# Altium schematic sheet microcontroller.SchDoc
size A4
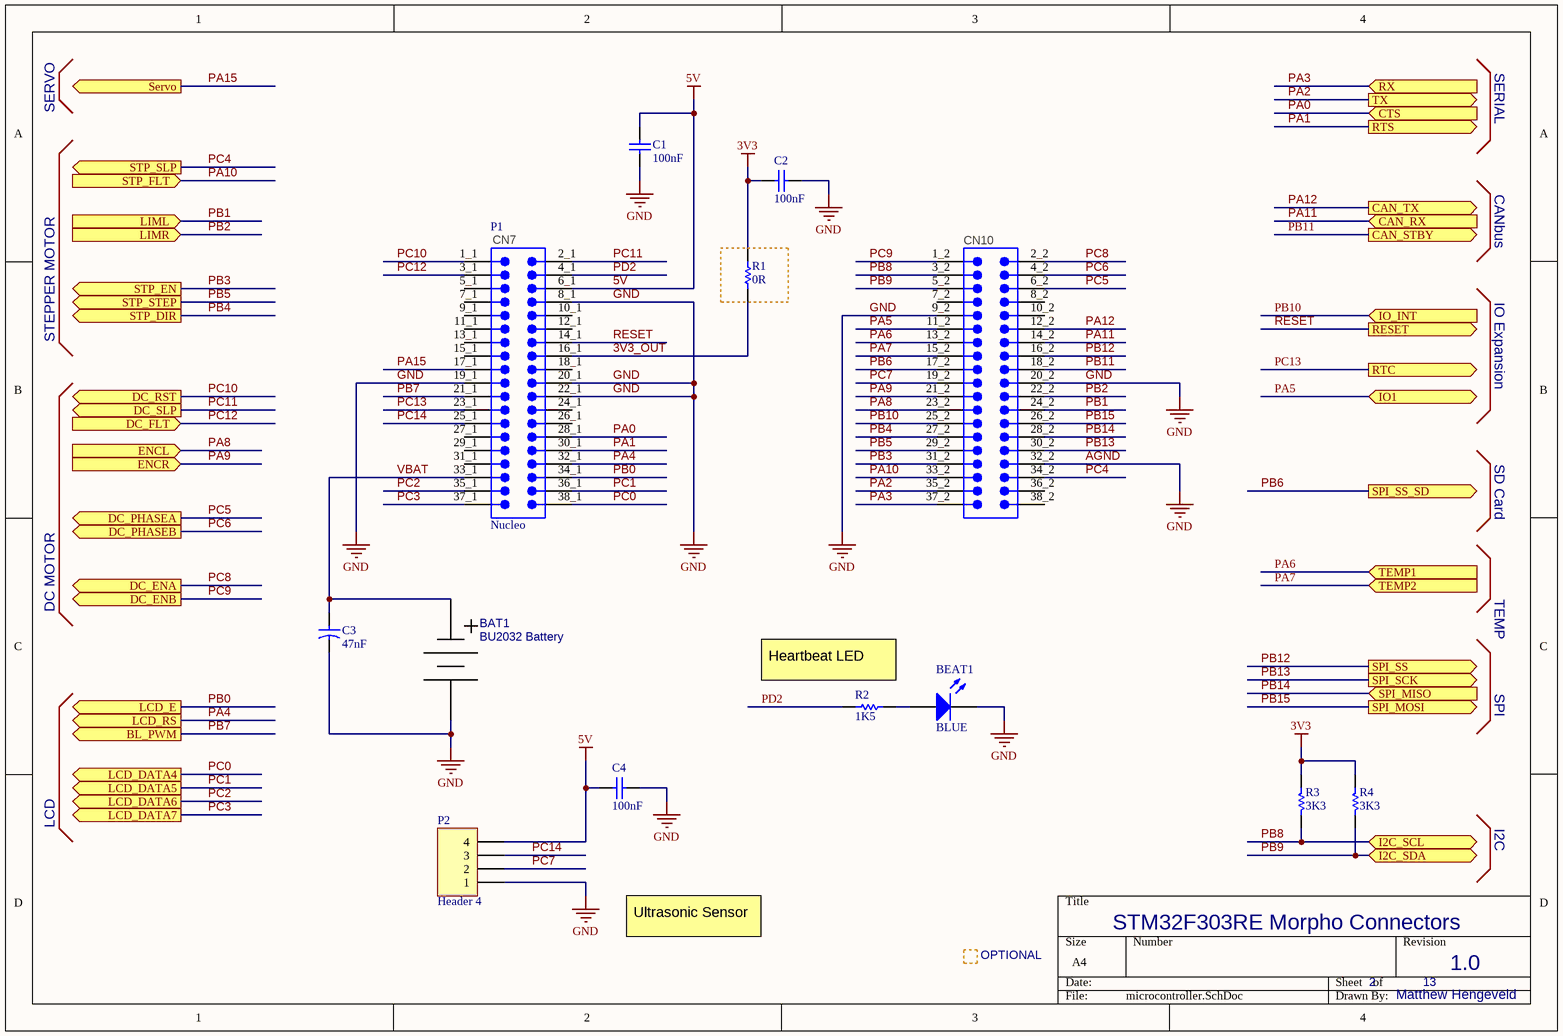
[diagram p0: microcontroller.SchDoc]

## Parts
BAT1  BU2032 Battery  [BU2032]
BEAT1  BLUE  [0805_A]
C1  100nF  [CAPC1608X92X38LL15T08]
C2  100nF  [CAPC1608X92X38LL15T08]
C3  47nF  [FILM_CAp]
C4  100nF  [CAPC1608X92X38LL15T08]
P1  Nucleo  [NUCLEO]
P2  Header 4  [HDR1X4]
R1  0R  [RESC1608X55X30LL15T15]
R2  1K5  [RESC1608X55X30LL15T15]
R3  3K3  [RESC1608X55X30LL15T15]
R4  3K3  [RESC1608X55X30LL15T15]

## Ports
BL_PWM (out), CAN_RX (in), CAN_STBY (out), CAN_TX (out), CTS (in), DC_ENA (out), DC_ENB (out), DC_FLT (in), DC_PHASEA (out), DC_PHASEB (out), DC_RST (out), DC_SLP (out), ENCL (in), ENCR (in), I2C_SCL (bidir), I2C_SDA (bidir), IO1 (bidir), IO_INT (in), LCD_DATA4 (out), LCD_DATA5 (out), LCD_DATA6 (out), LCD_DATA7 (out), LCD_E (out), LCD_RS (out), LIML (in), LIMR (in), RESET (out), RTC (out), RTS (out), RX (in), Servo (out), SPI_MISO (in), SPI_MOSI (out), SPI_SCK (out), SPI_SS (out), SPI_SS_SD (out), STP_DIR (out), STP_EN (out), STP_FLT (in), STP_SLP (out), STP_STEP (out), TEMP1 (in), TEMP2 (in), TX (out)

## Nets
3V3: C2.2 R1.2 R3.1 R4.1
5V: C1.2 C4.2 P1.6_1 P2.4
AGND: BAT1.- BEAT1.1(K) C1.1 C2.1 C3.2 C4.1 P1.8_1 P1.9_2 P1.19_1 P1.20_1 P1.20_2 P1.22_1 P1.32_2 P2.1  [also labelled GND]
3V3_OUT: P1.16_1 R1.1
PA0: P1.28_1 ; port CTS
PA1: P1.30_1 ; port RTS
PA2: P1.35_2 ; port TX
PA3: P1.37_2 ; port RX
PA4: P1.32_1 ; port LCD_RS
PA5: P1.11_2 ; port IO1
PA6: P1.13_2 ; port TEMP1
PA7: P1.15_2 ; port TEMP2
PA8: P1.23_2 ; port ENCL
PA9: P1.21_2 ; port ENCR
PA10: P1.33_2 ; port STP_FLT
PA11: P1.14_2 ; port CAN_RX
PA12: P1.12_2 ; port CAN_TX
PA15: P1.17_1 ; port Servo
PB0: P1.34_1 ; port LCD_E
PB1: P1.24_2 ; port LIML
PB2: P1.22_2 ; port LIMR
PB3: P1.31_2 ; port STP_EN
PB4: P1.27_2 ; port STP_DIR
PB5: P1.29_2 ; port STP_STEP
PB6: P1.17_2 ; port SPI_SS_SD
PB7: P1.21_1 ; port BL_PWM
PB8: P1.3_2 R3.2 ; port I2C_SCL
PB9: P1.5_2 R4.2 ; port I2C_SDA
PB10: P1.25_2 ; port IO_INT
PB11: P1.18_2 ; port CAN_STBY
PB12: P1.16_2 ; port SPI_SS
PB13: P1.30_2 ; port SPI_SCK
PB14: P1.28_2 ; port SPI_MISO
PB15: P1.26_2 ; port SPI_MOSI
PC0: P1.38_1 ; port LCD_DATA4
PC1: P1.36_1 ; port LCD_DATA5
PC2: P1.35_1 ; port LCD_DATA6
PC3: P1.37_1 ; port LCD_DATA7
PC4: P1.34_2 ; port STP_SLP
PC5: P1.6_2 ; port DC_PHASEA
PC6: P1.4_2 ; port DC_PHASEB
PC7: P1.19_2 P2.2
PC8: P1.2_2 ; port DC_ENA
PC9: P1.1_2 ; port DC_ENB
PC10: P1.1_1 ; port DC_RST
PC11: P1.2_1 ; port DC_SLP
PC12: P1.3_1 ; port DC_FLT
PC13: P1.23_1 ; port RTC
PC14: P1.25_1 P2.3
PD2: P1.4_1 R2.1
RESET: P1.14_1 ; port RESET
VBAT: BAT1.+ C3.1 P1.33_1
NetBEAT1_2: BEAT1.2(A) R2.2

Not connected (* = marked no-connect by the designer): P1 5_1(5) 7_1(7) 7_2(7) 8_2(8) 9_1(9) 10_1(10) 10_2(10) 11_1(11) 12_1(12) 13_1(13) 15_1(15) 18_1(18) 24_1(24) 26_1(26) 27_1(27) 29_1(29) 31_1(31) 36_2(36) 38_2(38)

## Notes on the sheet
- SERVO
- SERIAL
- CANbus
- IO Expansion
- STEPPER MOTOR
- SD Card
- DC MOTOR
- TEMP
- (near R2) Heartbeat LED
- SPI
- LCD
- I2C
- Ultrasonic Sensor
- OPTIONAL
- STM32F303RE Morpho Connectors
- 2
- 13
- 1.0
- Matthew Hengeveld
- (in symbol Nucleo) CN7; CN10

## Library data of the parts
BEAT1 = CMP-1426-00011-1: SMD mono-color Chip LED, WL-SMCW, Red; PartNumber: 150080RS75000; Manufacturer: Wuerth Elektronik; Color: Red; PackageReference: 0805_A; ComponentLink2Description: Datasheet; ComponentLink1URL: http://www.we-online.com; ComponentLink1Description: Manufacturer URL; ComponentLink2URL: http://katalog.we-online.com/led/datasheet/150080RS75000.pdf
C1 C2 C4 = CMP-2006-01974-1: Part Number: VJ0603Y104KNXAO; Manufacturer: Vitramon
C3 = CAP-FILM: Aluminum Electrolytic Capacitor, UD Series, Low Impedance, 100 uF, 35 V, + / - 20%, -55 to 105 degC, Chip Type, 8 x 10 mm D x L, Pb-Free, Reel; PartNumber: UUD1V101MNL1GS; Manufacturer: Nichicon; Rated Ripple Current (at 100kHz): 450 mA; Packing: Dia382mm Reel; Endurance Time: 5000 h; Impedance: 0.17 Ohm; Rated Voltage: 35 V; Rated Capacitance: 100 uF; Tolerance Rated Capacitance: -20 to 20%; ComponentLink2URL: http://products.nichicon.co.jp/en/pdf/XJA043/e-ud.pdf; DatasheetVersion: 08/2012; ComponentLink1Description: Manufacturer URL; Diameter: 8 mm; RoHS: TRUE; ComponentLink3Description: Package Specification; Mounting Technology: Surface Mount; ComponentLink3URL: http://products.nichicon.co.jp/en/pdf/XJA043/e-ud.pdf; Length: 10 mm; PackageReference: CAPAE-D8H10; ComponentLink1URL: http://www.nichicon.co.jp/; ComponentLink2Description: Datasheet; PackageDescription: 2-Pin Surface Mount Device, Diameter 8 mm, Height 10 mm, Pitch 6.5 mm
P1 = Nucleo: STM32F303 Nucleo Development Board; Manufacturer: Samtec; PartNumber: HW-20-08-F-D-255-090; Pitch: 2.54 mm; DatasheetVersion: F-214; PackageVersion: Y, 8/1991; PackageReference: HW-20-08-X-D-255-090; PackageDescription: .100[2.54] High Temp Terminal Body (Board Stacking); Orientation: Vertical; RoHS: True; Temperature Range: -55 to 125 degC; Mounting Technology: Through-hole; ComponentLink1Description: Datasheet; ComponentLink1URL: http://www.samtec.com/documents/webfiles/pdf/HW_TH.PDF; ComponentLink2Description: Package Specification; ComponentLink2URL: http://www.samtec.com/documents/webfiles/cpdf/HW-XX-XX-XX-X-XXX-XXX-XX-XXX-MKT.pdf
P2 = Header 4: Header, 4-Pin; LatestRevisionDate: 17-Jul-2002; LatestRevisionNote: Re-released for DXP Platform.; Publisher: Altium Limited
R1-R4 = CMP-2000-00704-1: Manufacturer: Panasonic; Part Number: ERJ-3GEYJ103V